# EAGLE design tagon (EAGLE 9.1.1)
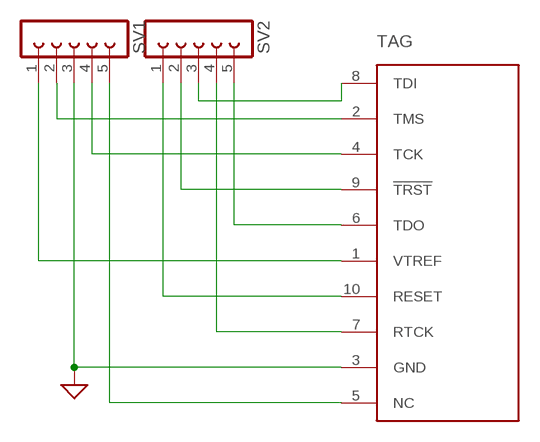
[diagram p0: schematic, sheet 1]

## Parts
SV1  FE05-1  [FE05-1]
SV2  FE05-1  [FE05-1]
TAG  TC2050-MCP-NL  [TC2030-MCP-NL]

## Nets
GND: SV1.3 TAG.3(GND) ; supply symbol labelled SUP
N$1: SV1.1 TAG.1(VTREF)
N$2: SV1.2 TAG.2(TMS)
N$4: SV1.4 TAG.4(TCK)
N$5: SV1.5 TAG.5(NC)
N$6: SV2.5 TAG.6(TDO)
N$7: SV2.4 TAG.7(RTCK)
N$8: SV2.3 TAG.8(TDI)
N$9: SV2.2 TAG.9(!TRST)
N$10: SV2.1 TAG.10(RESET)

## Library data of the parts
SV1 SV2 = con-lsta:FE05-1: FEMALE HEADER; OC_FARNELL: unknown; OC_NEWARK: unknown
TAG = TC2050:TC2050: TAG-CONNECT ISP Connector Manufacturer: Tag-Connect <www.tag-connect.com> Cable for easy In-Circuit PCB Programming. Designed for JTAG 10 pin, suitable for many others. Pin Connection for TC2050 NL. PAD Description 1 VTREF 2 TMS 3 GND 4 TCK 5 NC 6 TDO 7 RTCK 8 TDI 9 !TRST 10 RESET ©2009 ROFA.cz Modified 7/2011 by Tim McCarthy-Smith VIDA Products INC

## Board
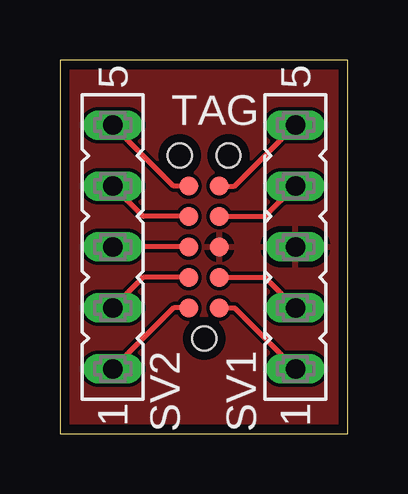
[diagram p1: board, top side]
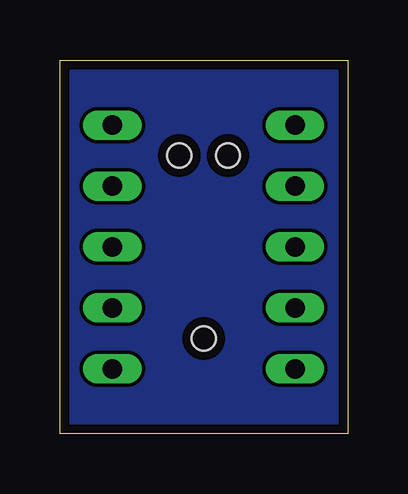
[diagram p2: board, bottom side, seen from below]

Size 12.01 x 15.57 mm. Coordinates in mm from the lower left corner, seen from the top.
Outline: 0,0 12.01,0 12.01,15.57 0,15.57 0,0
Copper layers (1*16): Top 0.035559375mm / dielectric 1.6mm / Bottom 0.035559375mm
Design rules "oshpark-2layer": minimum track width 6mil, minimum drill 10mil, track to track 6mil, track to pad 6mil, pad to pad 6mil, via to via 6mil, smd to smd 6mil, copper to edge 15mil, drill to drill 6mil, minimum pad ring 5mil, minimum via ring 5mil, stop-mask expansion 2.5mil, vias tented up to drill 0mil, thermal gap 10mil

### Footprints (pad centres in the part's own frame; a part is rotated, then mirrored left to right if it is on the bottom)
FE05-1 = drill 0.813 long: 1 -5.08,0; 2 -2.54,0; 3 0,0; 4 2.54,0; 5 5.08,0
TC2030-MCP-NL = smd 0.787 x 0.787: 1 1.27,-0.635; 2 2.54,-0.635; 3 3.81,-0.635; 4 5.08,-0.635; 5 6.35,-0.635; 6 6.35,0.635; 7 5.08,0.635; 8 3.81,0.635; 9 2.54,0.635; 10 1.27,0.635 | hole 1: 0,0; 7.62,-1.016; 7.62,1.016

### Placement (x,y rotation side)
SV1  9.82,7.79 90 top
SV2  2.21,7.79 90 top
TAG  6.01,3.98 90 top

### Tracks (layer width: path | path; a pad name or v marks a point on that pad's centre or on a via)
GND
  pour Top: 0,0 0,15.6 12,15.6 12,0
N$1
  Top 0.2: TAG.1 7.29,5.25 SV1.1
N$2
  Top 0.2: TAG.2 8.55,6.51 SV1.2
N$4
  Top 0.2: TAG.4 8.55,9.05 SV1.4
N$5
  Top 0.2: TAG.5 7.29,10.32 SV1.5
N$6
  Top 0.2: TAG.6 4.75,10.32 SV2.5
N$7
  Top 0.2: TAG.7 3.48,9.05 SV2.4
N$8
  Top 0.2: TAG.8 SV2.3
N$9
  Top 0.2: TAG.9 3.48,6.51 SV2.2
N$10
  Top 0.2: TAG.10 4.75,5.25 SV2.1
N/A
  pour Bottom: 0,15.6 12,15.6 12,0 0,0